# Altium schematic sheet DriversBoard.SchDoc: Power
size A4; CompanyName: SpaceBee Technologies; Organization: Open Space; Revision: 0; SheetNumber: 2; SheetTotal: 8; Mail: mgmt@spacebeetech.com; Project: Rovertito; ProjectName: Driver Board
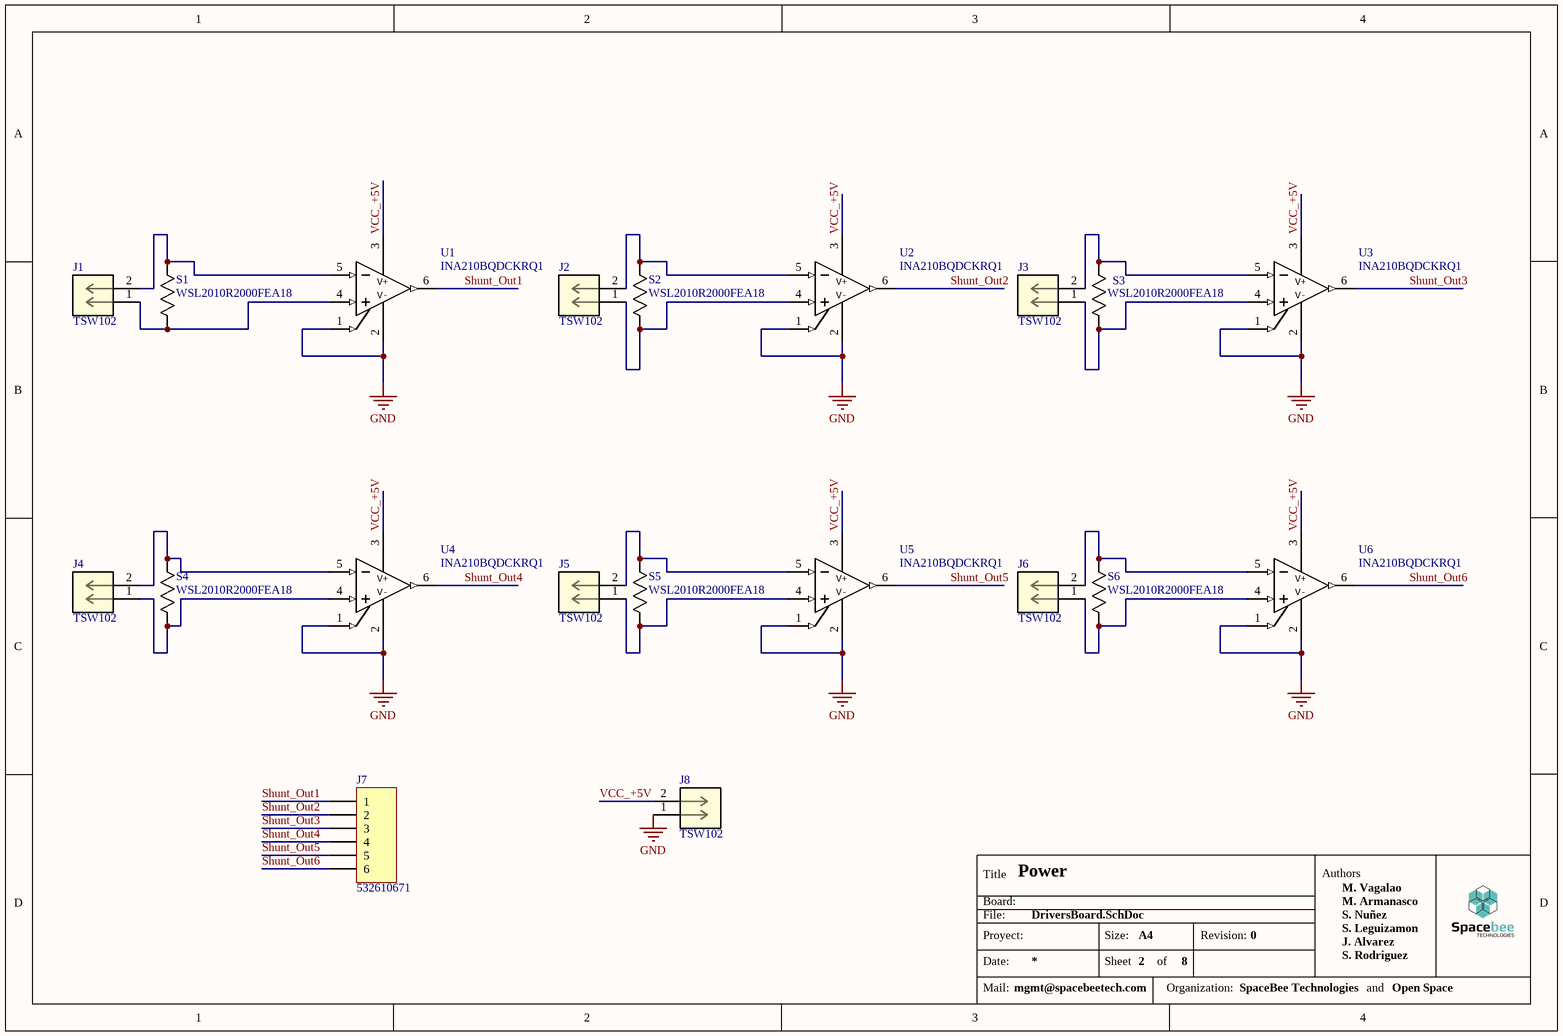
[diagram p0: DriversBoard.SchDoc]

## Parts
J1  TSW102  [MOLEX_53261-0271]
J2  TSW102  [MOLEX_53261-0271]
J3  TSW102  [MOLEX_53261-0271]
J4  TSW102  [MOLEX_53261-0271]
J5  TSW102  [MOLEX_53261-0271]
J6  TSW102  [MOLEX_53261-0271]
J7  532610671  [MOLEX_532610671]
J8  TSW102  [MOLEX_53261-0271]
S1  WSL2010R2000FEA18  [RC2010N_VIS-L]
S2  WSL2010R2000FEA18  [RC2010N_VIS-L]
S3  WSL2010R2000FEA18  [RC2010N_VIS-L]
S4  WSL2010R2000FEA18  [RC2010N_VIS-L]
S5  WSL2010R2000FEA18  [RC2010N_VIS-L]
S6  WSL2010R2000FEA18  [RC2010N_VIS-L]
U1  INA210BQDCKRQ1  [INA210BQDCKRQ1]
U2  INA210BQDCKRQ1  [INA210BQDCKRQ1]
U3  INA210BQDCKRQ1  [INA210BQDCKRQ1]
U4  INA210BQDCKRQ1  [INA210BQDCKRQ1]
U5  INA210BQDCKRQ1  [INA210BQDCKRQ1]
U6  INA210BQDCKRQ1  [INA210BQDCKRQ1]

## Nets
GND: J8.1 U1.1(REF) U1.2(GND) U2.1(REF) U2.2(GND) U3.1(REF) U3.2(GND) U4.1(REF) U4.2(GND) U5.1(REF) U5.2(GND) U6.1(REF) U6.2(GND)
Shunt_Out1: J7.1 U1.6(OUT)
Shunt_Out2: J7.2 U2.6(OUT)
Shunt_Out3: J7.3 U3.6(OUT)
Shunt_Out4: J7.4 U4.6(OUT)
Shunt_Out5: J7.5 U5.6(OUT)
Shunt_Out6: J7.6 U6.6(OUT)
VCC_+5V: J8.2 U1.3(V+) U2.3(V+) U3.3(V+) U4.3(V+) U5.3(V+) U6.3(V+)
NetJ1_1: J1.1 S1.2 U1.4(IN+)
NetJ1_2: J1.2 S1.1 U1.5(IN-)
NetJ2_1: J2.1 S2.2 U2.4(IN+)
NetJ2_2: J2.2 S2.1 U2.5(IN-)
NetJ3_1: J3.1 S3.2 U3.4(IN+)
NetJ3_2: J3.2 S3.1 U3.5(IN-)
NetJ4_1: J4.1 S4.2 U4.4(IN+)
NetJ4_2: J4.2 S4.1 U4.5(IN-)
NetJ5_1: J5.1 S5.2 U5.4(IN+)
NetJ5_2: J5.2 S5.1 U5.5(IN-)
NetJ6_1: J6.1 S6.2 U6.4(IN+)
NetJ6_2: J6.2 S6.1 U6.5(IN-)

## Notes on the sheet
- Title
- Board:
- File:
- Authors
- M. Armanasco
- S. Nuñez
- M. Vagalao
- Proyect:
- Date:
- Mail:
- Size:
- Sheet
- A4
- of
- Organization:
- Revision:
- S. Rodriguez
- S. Leguizamon
- J. Alvarez
- and
- (in symbol INA210BQDCKRQ1) V-

## Library data of the parts
S1-S6 = WSL2010R2000FEA18: No Description Available; Mfr_Name: Vishay; Copyright: Copyright (C) 2022 Ultra Librarian. All rights reserved.; Manufacturer_Part_Number: WSL2010R2000FEA18; RefDes: RefDes; Type: DEV
U1-U6 = INA210BQDCKRQ1: Part Number: 296-44263-2-ND
J7 = 532610671: LatestRevisionDate: 17-Jul-2002; LatestRevisionNote: Re-released for DXP Platform.; Publisher: Altium Limited